# Altium schematic sheet Papilio_DUO_3.SchDoc: Papilio_DUO
size 423 x 288 mm; Date: 05/10/2018 09:53:59 p.m.; Organization: INVAP S.E.; Address1: Argentina; Address2: Rio Negro; Address3: Bariloche; Address4: Cte. Luis Piedra Buena 4950; SheetNumber: 4; DATABASE: C:/Dropbox/GadgetFactory/GadgetFactory_Engineering/Libraries/GadgetFactory-PARTSDB.txt; Rule: PcbType=ProtelPcb
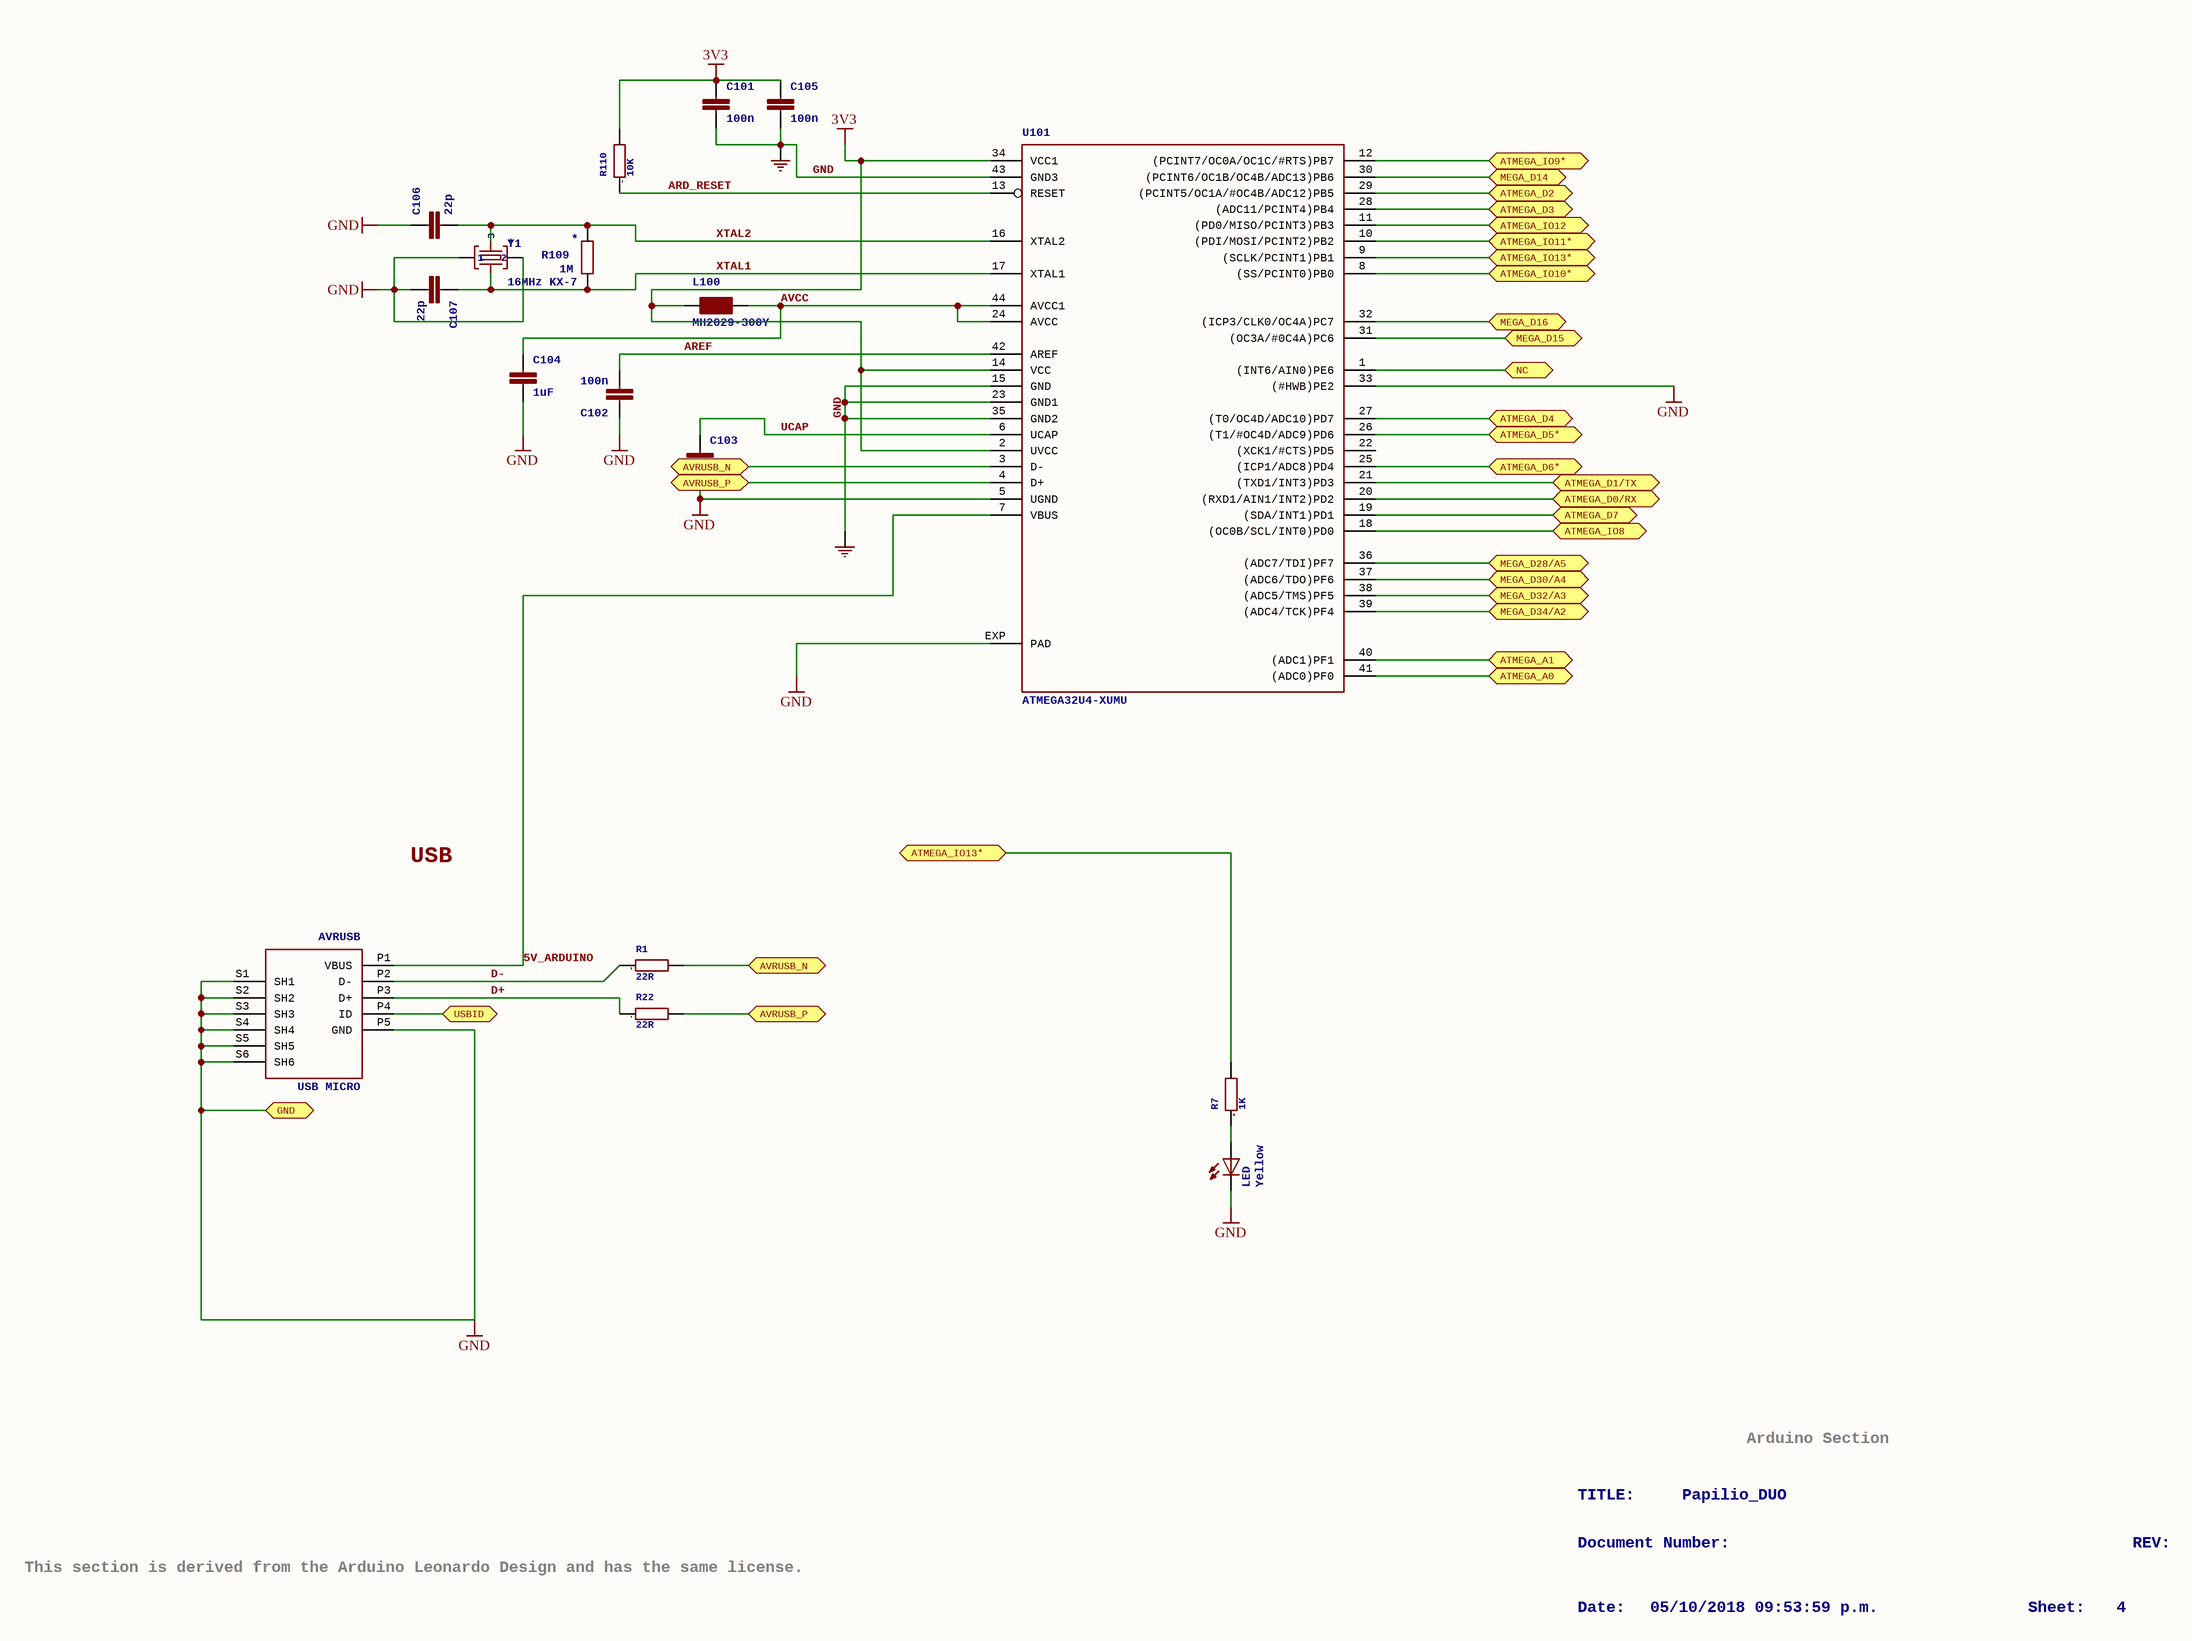
[diagram p0: Papilio_DUO_3.SchDoc]

## Parts
AVRUSB  USB MICRO  [CON2_USB_MICRO_B_AT]
C101  100n  [C0603K]
C102  100n  [C0603K]
C103  1uF  [C0603K]
C104  1uF  [C0603K]
C105  100n  [C0603K]
C106  22p  [C0603K]
C107  22p  [C0603K]
L100  MH2029-300Y  [0805]
LED  Yellow  [CHIPLED_0805]
R1  22R  [0805]
R7  1K  [0603]
R22  22R  [0805]
R109  1M  [R0603-ROUND]
R110  10K  [0603]
U101  ATMEGA32U4-XUMU  [QFN44ML7X7]
U$30  COM  (value not drawn)
U$40  COM  (value not drawn)
Y1  16MHz KX-7  [CRYSTAL-3.2-2.5]

## Ports
ATMEGA_A0, ATMEGA_A1, ATMEGA_D0/RX, ATMEGA_D1/TX, ATMEGA_D2, ATMEGA_D3, ATMEGA_D4, ATMEGA_D5*, ATMEGA_D6*, ATMEGA_D7, ATMEGA_IO8, ATMEGA_IO9*, ATMEGA_IO10*, ATMEGA_IO11*, ATMEGA_IO12, ATMEGA_IO13*, AVRUSB_N, AVRUSB_P, GND, MEGA_D14, MEGA_D15, MEGA_D16, MEGA_D28/A5, MEGA_D30/A4, MEGA_D32/A3, MEGA_D34/A2, NC, USBID

## Nets
3V3: C101.1 C105.1 L100.1 R110.2 U101.2(UVCC) U101.14(VCC) U101.34(VCC1)
GND: AVRUSB.P5(GND) AVRUSB.S1(SH1) AVRUSB.S2(SH2) AVRUSB.S3(SH3) AVRUSB.S4(SH4) AVRUSB.S5(SH5) AVRUSB.S6(SH6) C101.2 C102.1 C103.2 C104.2 C105.2 C106.1 C107.2 LED.C U101.5(UGND) U101.15(GND) U101.23(GND1) U101.33((#HWB)PE2) U101.35(GND2) U101.43(GND3) U101.EXP(PAD) U$30.?1(COM) U$40.?1(COM) Y1.2(GND) Y1.4(GND) ; port GND
5V_ARDUINO: AVRUSB.P1(VBUS) U101.7(VBUS)
ARD_RESET: R110.1 U101.13(RESET)
AREF: C102.2 U101.42(AREF)
ATMEGA_A0: U101.41((ADC0)PF0) ; port ATMEGA_A0
ATMEGA_A1: U101.40((ADC1)PF1) ; port ATMEGA_A1
ATMEGA_D0/RX: U101.20((RXD1/AIN1/INT2)PD2) ; port ATMEGA_D0/RX
ATMEGA_D1/TX: U101.21((TXD1/INT3)PD3) ; port ATMEGA_D1/TX
ATMEGA_D2: U101.29((PCINT5/OC1A/#OC4B/ADC12)PB5) ; port ATMEGA_D2
ATMEGA_D3: U101.28((ADC11/PCINT4)PB4) ; port ATMEGA_D3
ATMEGA_D4: U101.27((T0/OC4D/ADC10)PD7) ; port ATMEGA_D4
ATMEGA_D5*: U101.26((T1/#OC4D/ADC9)PD6) ; port ATMEGA_D5*
ATMEGA_D6*: U101.25((ICP1/ADC8)PD4) ; port ATMEGA_D6*
ATMEGA_D7: U101.19((SDA/INT1)PD1) ; port ATMEGA_D7
ATMEGA_IO8: U101.18((OC0B/SCL/INT0)PD0) ; port ATMEGA_IO8
ATMEGA_IO9*: U101.12((PCINT7/OC0A/OC1C/#RTS)PB7) ; port ATMEGA_IO9*
ATMEGA_IO10*: U101.8((SS/PCINT0)PB0) ; port ATMEGA_IO10*
ATMEGA_IO11*: U101.10((PDI/MOSI/PCINT2)PB2) ; port ATMEGA_IO11*
ATMEGA_IO12: U101.11((PD0/MISO/PCINT3)PB3) ; port ATMEGA_IO12
ATMEGA_IO13*: R7.2 U101.9((SCLK/PCINT1)PB1) ; port ATMEGA_IO13*
AVCC: C104.1 L100.2 U101.24(AVCC) U101.44(AVCC1)
AVRUSB_N: R1.2 U101.3(D-) ; port AVRUSB_N
AVRUSB_P: R22.2 U101.4(D+) ; port AVRUSB_P
D+: AVRUSB.P3(D+) R22.1
D-: AVRUSB.P2(D-) R1.1
MEGA_D14: U101.30((PCINT6/OC1B/OC4B/ADC13)PB6) ; port MEGA_D14
MEGA_D15: U101.31((OC3A/#0C4A)PC6) ; port MEGA_D15
MEGA_D16: U101.32((ICP3/CLK0/OC4A)PC7) ; port MEGA_D16
MEGA_D28/A5: U101.36((ADC7/TDI)PF7) ; port MEGA_D28/A5
MEGA_D30/A4: U101.37((ADC6/TDO)PF6) ; port MEGA_D30/A4
MEGA_D32/A3: U101.38((ADC5/TMS)PF5) ; port MEGA_D32/A3
MEGA_D34/A2: U101.39((ADC4/TCK)PF4) ; port MEGA_D34/A2
NC: U101.1((INT6/AIN0)PE6) ; port NC
UCAP: C103.1 U101.6(UCAP)
USBID: AVRUSB.P4(ID) ; port USBID
XTAL1: C107.1 R109.1 U101.17(XTAL1) Y1.1(C1)
XTAL2: C106.2 R109.2 U101.16(XTAL2) Y1.3(C2)
NetLED_A: LED.A R7.1

Not connected (* = marked no-connect by the designer): U101 22((XCK1/#CTS)PD5)

## Notes on the sheet
- USB
- Arduino Section
- TITLE:
- Document Number:
- Papilio_DUO
- REV:
- This section is derived from the Arduino Leonardo Design and has the same license.
- Date:
- 05/10/2018 09:53:59 p.m.
- Sheet:
- 4
- Título:
- Nº
- Hoja:
- de:
- Escala:
- *

## Library data of the parts
AVRUSB = MYCON2_USB-MINI-B: PARTNO: *
C101-C107 = C-EUC0603K: CAPACITOR, European symbol; PARTNO: *
L100 = WE-CBF_0805: SMD EMI Suppression Ferrite Beads - excellent anti-EMI properties - low DCR - impedances till 3000 ohms - rated current up to 6 A; PARTNO: *
LED = LEDCHIPLED_0805: LED   OSRAM: - CHIPLED LG R971, LG N971, LY N971, LG Q971, LY Q971, LO R971, LY R971 LH N974, LH R974 LS Q976, LO Q976, LY Q976 LO Q996 - Hyper CHIPLED LW Q18S LB Q993, LB Q99A, LB R99A - SideLED LS A670, LO A670, LY A670, LG A670, LP A670 LB A673, LV A673, LT A673, LW A673 LH A674 LY A675 LS A676, LA A676, LO A676, LY A676, LW A676 LS A679, LY A679, LG A679 -  Hyper Micro SIDELEDï¿½ LS Y876, LA Y876, LO Y876, LY Y876 LT Y87S - SmartLED LW L88C, LW L88S LB L89C, LB L89S, LG L890 LS L89K, LO L89K, LY L89K LS L896, LA L896, LO L896, LY L896 - TOPLED LS T670, LO T670, LY T670, LG T670, LP T670 LSG T670, LSP T670, LSY T670, LOP T670, LYG T670 LG T671, LOG T671, LSG T671 LB T673, LV T673, LT T673, LW T673 LH T674 LS T676, LA T676, LO T676, LY T676, LB T676, LH T676, LSB T676, LW T676 LB T67C, LV T67C, LT T67C, LS T67K, LO T67K, LY T67K, LW E67C LS E67B, LA E67B, LO E67B, LY E67B, LB E67C, LV E67C, LT E67C LW T67C LS T679, LY T679, LG T679 LS T770, LO T770, LY T770, LG T770, LP T770 LB T773, LV T773, LT T773, LW T773 LH T774 LS E675, LA E675, LY E675, LS T675 LS T776, LA T776, LO T776, LY T776, LB T776 LHGB T686 LT T68C, LB T68C - Hyper Mini TOPLEDï¿½ LB M676 - Mini TOPLED Santanaï¿½ LG M470 LS M47K, LO M47K, LY M47K    Source: http://www.osram.convergy.de   LUXEON: - LUMILEDï¿½ LXK2-PW12-R00, LXK2-PW12-S00, LXK2-PW14-U00, LXK2-PW14-V00 LXK2-PM12-R00, LXK2-PM12-S00, LXK2-PM14-U00 LXK2-PE12-Q00, LXK2-PE12-R00, LXK2-PE12-S00, LXK2-PE14-T00, LXK2-PE14-U00 LXK2-PB12-K00, LXK2-PB12-L00, LXK2-PB12-M00, LXK2-PB14-N00, LXK2-PB14-P00, LXK2-PB14-Q00 LXK2-PR12-L00, LXK2-PR12-M00, LXK2-PR14-Q00, LXK2-PR14-R00 LXK2-PD12-Q00, LXK2-PD12-R00, LXK2-PD12-S00 LXK2-PH12-R00, LXK2-PH12-S00 LXK2-PL12-P00, LXK2-PL12-Q00, LXK2-PL12-R00    Source: www.luxeon.com   KINGBRIGHT:   KA-3528ASYC Source: www.kingbright.com; PARTNO: *
R1 R22 = R0805: RESISTOR, European symbol; PARTNO: *
R7 R110 = R0603: RESISTOR, European symbol; PARTNO: *
R109 = R-EU_R0603: RESISTOR, European symbol; NAME: *; PARTNO: *
Y1 = CRYSTAL-3.2-2.5: NAME: *; PARTNO: *; 1: 1; 2: 2; 3: 3
U101 = ATMEGA32U4-XUMU: PARTNO: *